# Altium schematic sheet tl494.SchDoc
size A4; SheetNumber: 1; SheetTotal: 8
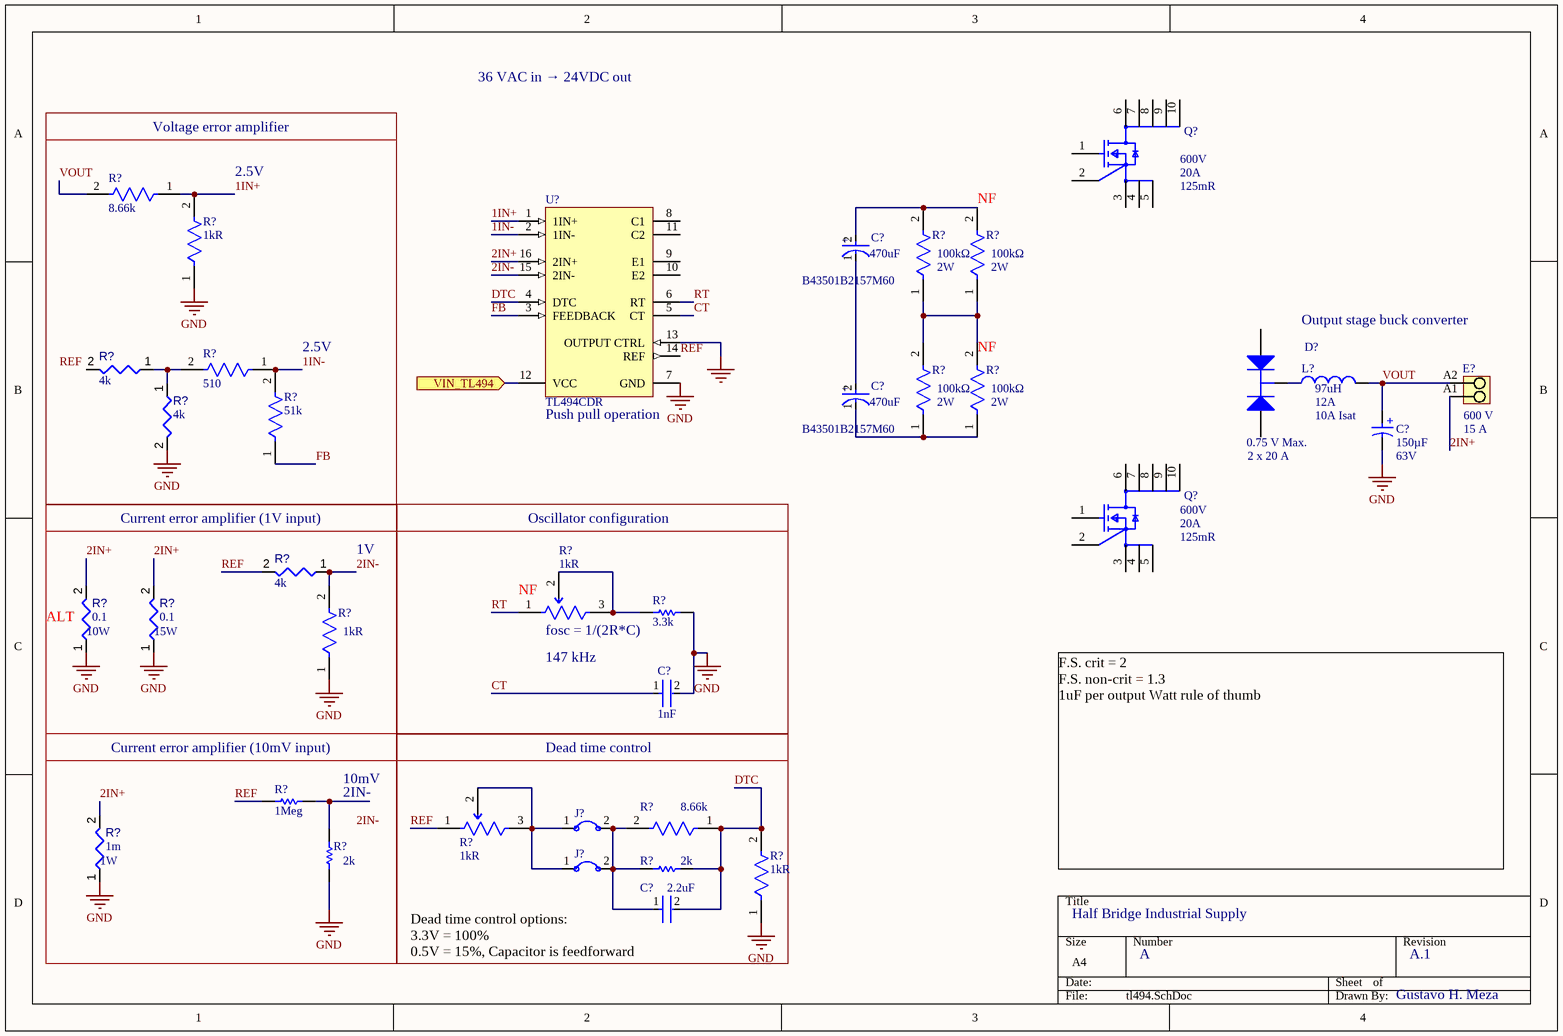
[diagram p0: tl494.SchDoc]

## Parts
(Parts that share a designator on the sheet are numbered #1, #2 ... from top to bottom, then left to right.)
C?#1  Capacitance: 470uF  [FP-EETHC2G471DA-MFG]  (hidden comment: EETHC2G471DA)
C?#2  Capacitance: 470uF  [FP-EETHC2G471DA-MFG]  (hidden comment: EETHC2G471DA)
C?#3  Capacitance: 150µF  Vrating: 63V  [WCAP-ATG5_D10H16]  (hidden comment: 860020775017)
C?#4  Capacitance: 1nF  [FP-0805-L_2_01_0_2-W_1_25-MFG]  (hidden comment: 08051A102JAT2A)
C?#5  Capacitance: 2.2uF  [FP-C2012-125-0_2-IPC_B]  (hidden comment: C2012X7R1H225K125AC)
D?  VF: 0.75 V Max.  IF(AV): 2 x 20 A  [STM-TO-220AB-3]  (hidden comment: STPS40170CT)
E?  Rated_voltage_for_surge_voltage_class_pollution_degree_II_2: 600 V  Rated_current_use_group_B_UL_1059: 15 A  [PM_5_08_90_02]  (hidden comment: 1760490000)
J?#1  JUMPER  [JUMPER]  (value not drawn)
J?#2  JUMPER  [JUMPER]  (value not drawn)
L?  value 97uH  DC Current: 12A  DC Saturation: 10A Isat  [PHBC20-1R7A0097V-Footprint-1]  (hidden comment: PHBC20-1R7A0097V)
Q?#1  Rds On Max: 125mR  Continuous Drain Current (ID): 20A  Drain to Source Voltage (Vdss): 600V  [FP-PG-HDSOP-10-MFG]  (hidden comment: IPDD60R125G7XTMA1)
Q?#2  Rds On Max: 125mR  Continuous Drain Current (ID): 20A  Drain to Source Voltage (Vdss): 600V  [FP-PG-HDSOP-10-MFG]  (hidden comment: IPDD60R125G7XTMA1)
R?#1  Resistance: 8.66k  [FP-RT0805-MFG]  (hidden comment: RT0805BRD078K66L)
R?#2  Resistance: 1kR  [FP-ERA6A-IPC_C]  (hidden comment: ERA6AEB102V)
R?#3  Resistance: 100kΩ  Power Rating: 2W  [FP-PR02000201003JA100-MFG]  (hidden comment: PR02000201003JA100)
R?#4  Resistance: 100kΩ  Power Rating: 2W  [FP-PR02000201003JA100-MFG]  (hidden comment: PR02000201003JA100)
R?#5  value 4k  [RESC3416X05N]  (hidden comment: CRCW08054K00FKTA)
R?#6  Resistance: 510  [FP-CR0805-IPC_B]  (hidden comment: CR0805JW511E)
R?#7  value 4k  [RESC3416X05N]  (hidden comment: CRCW08054K00FKTA)
R?#8  Resistance: 100kΩ  Power Rating: 2W  [FP-PR02000201003JA100-MFG]  (hidden comment: PR02000201003JA100)
R?#9  Resistance: 100kΩ  Power Rating: 2W  [FP-PR02000201003JA100-MFG]  (hidden comment: PR02000201003JA100)
R?#10  Resistance: 51k  [FP-RT0805-MFG]  (hidden comment: RT0805BRD0751KL)
R?#11  value 4k  [RESC3416X05N]  (hidden comment: CRCW08054K00FKTA)
R?#12  Resistance: 1kR  [FP-248FGJSPXB25102MA-MFG]  (hidden comment: 248FGJSPXB25102MA)
R?#13  Resistance: 3.3k  [RESC2013X60X35ML10T20]  (hidden comment: RC0805FR-073K3L)
R?#14  value 0.1  Power: 10W  [20JR10-Footprint-1]  (hidden comment: 20JR10)
R?#15  value 0.1  Power: 15W  [WH10-R10JI-Footprint-1]  (hidden comment: WH10-R10JI)
R?#16  Resistance: 1kR  [FP-ERA6A-IPC_C]  (hidden comment: ERA6AEB102V)
R?#17  Resistance: 1Meg  [RESC3116X65X40ML10T20]  (hidden comment: RT1206BRD071ML)
R?#18  Resistance: 1kR  [FP-248FGJSPXB25102MA-MFG]  (hidden comment: 248FGJSPXB25102MA)
R?#19  Resistance: 8.66k  [FP-RT0805-MFG]  (hidden comment: RT0805BRD078K66L)
R?#20  Resistance: 2k  [RESC2013X60X35ML10T20]  (hidden comment: RT0805BRD072KL)
R?#21  value 1m  Power: 1W  [RESC3416X05N]  (hidden comment: KRL2012E-C-R001-J-T5)
R?#22  Resistance: 2k  [RESC2013X60X35ML10T20]  (hidden comment: RT0805BRD072KL)
R?#23  Resistance: 1kR  [FP-ERA6A-IPC_C]  (hidden comment: ERA6AEB102V)
U?  TL494CDR  [D0016A_N]

## Blocks framed on the sheet
Dead time control: C?#5 J?#1 J?#2 R?#18 R?#19 R?#22 R?#23

## Ports
VIN_TL494 (in)

## Nets
GND: C?#3.2(N) C?#4.2 R?#2.1 R?#7.2 R?#13.1 R?#14.1 R?#15.1 R?#16.1 R?#20.1 R?#21.1 R?#23.1 U?.7(GND) U?.13(OUTPUT_CTRL)
1IN+: R?#1.1 R?#2.2 U?.1(1IN+)
1IN-: R?#6.1 R?#10.2 U?.2(1IN-)
2IN+: E?.A1 R?#14.2 R?#15.2 R?#21.2 U?.16(2IN+)
2IN-: R?#11.1 R?#16.2 U?.15(2IN-)
CT: C?#4.1 U?.5(CT)
DTC: C?#5.2 R?#19.1 R?#22.1 R?#23.2 U?.4(DTC)
FB: R?#10.1 U?.3(FEEDBACK)
REF: R?#11.2 R?#17.2 R?#18.1 U?.14(REF)
RT: R?#12.1 U?.6(RT)
VIN_TL494: U?.12(VCC) ; port VIN_TL494
VOUT: C?#3.1(P) E?.A2 L?.2 R?#1.2
NetC?#1_1: C?#1.1(C) C?#2.2(A)
NetC?#1_2: C?#1.2(A) R?#3.2 R?#4.2
NetC?#2_1: C?#2.1(C) R?#8.1 R?#9.1
NetC?#5_1: C?#5.1 J?#1.2 J?#2.2 R?#19.2 R?#22.2
NetD?_2: D?.2(K) L?.1
NetJ?#1_1: J?#1.1 J?#2.1 R?#18.2(CW) R?#18.3
NetR?#3_1: R?#3.1 R?#4.1 R?#8.2 R?#9.2
NetR?#5_1: R?#5.1 R?#6.2 R?#7.1
NetR?#12_2: R?#12.2(CW) R?#12.3 R?#13.2
NetR?#17_1: R?#17.1 R?#20.2

Not connected (* = marked no-connect by the designer): D? 1(A1) 3(A2); Q?#1 1(Gate) 2(Driver_Source) 3(Source) 4(Source) 5(Source) 6(Drain) 7(Drain) 8(Drain) 9(Drain) 10(Drain); Q?#2 1(Gate) 2(Driver_Source) 3(Source) 4(Source) 5(Source) 6(Drain) 7(Drain) 8(Drain) 9(Drain) 10(Drain); R?#5 2; U? 8(C1) 9(E1) 10(E2) 11(C2)

## Notes on the sheet
- 36 VAC in → 24VDC out
- Voltage error amplifier
- 2.5V
- (near R?#4) NF
- B43501B2157M60
- (near R?#10) 2.5V
- (near R?#9) NF
- Output stage buck converter
- (near U?) Push pull operation
- (near R?#11) Current error amplifier (1V input)
- Oscillator configuration
- (near R?#11) 1V
- (near R?#14) ALT
- (near R?#12) NF
- (near R?#13) fosc = 1/(2R*C)
- (near R?#12) 147 kHz
- (near R?#17) Current error amplifier (10mV input)
- (near R?#17) 10mV
- (near R?#17) 2IN-
- F.S. crit = 2
  F.S. non-crit = 1.3
  1uF per output Watt rule of thumb
- Half Bridge Industrial Supply
- (near C?#5) Dead time control options:
  3.3V = 100%
  0.5V = 15%, Capacitor is feedforward
- A
- A.1
- Gustavo H. Meza
- Labels drawn without touching a wire or pin: 2IN-, REF
- (in symbol CMP-03913-53914258-1) +
- (in symbol CMP-05427-002182-1) +

## Library data of the parts
C?#1 C?#2 = CMP-05427-002182-1: CAP ALUM 470UF 20% 400V SNAP; Lead Diameter: 0.8mm; Dissipation Factor: 15%; Dielectric Material: Aluminium; ESR (Equivalent Series Resistance): 388mR; Ripple Current: 1.68A; Hole Diameter: 2mm; Test Frequency: 120Hz; Life (Hours): 2000Hour; Length: 45mm; Lead Pitch: 10mm; Voltage Rating (DC): 400V; Height - Seated (Max): 1.85inch; Package Quantity: 100; Diameter: 30mm; Min Operating Temperature: -25°C; Mount: Through Hole; Voltage: 400V; Radiation Hardening: No; Reach SVHC Compliant: Yes; Packaging: Bulk; Lead Free: Lead Free; Height: 45mm; Tolerance: 20%; Width: 1.5inch; Case/Package: Radial; Voltage Rating: 400V; Series: TS-HC; Number of Pins: 2; Termination: Snap in; RoHS Compliant: Yes; Max Operating Temperature: 105°C; Ripple Current (AC): 1.68A; Weight: 0.15lb
  C?#1: Vrating: 400V
C?#3 = CMP-03913-53914258-1: 860020775017 Aluminium Electrolytic Capacitor, WCAP-ATG5 Series, 150 F, 20%, 63 V, 10 mm, Radial Leaded; Leakage Current: 94.5µA; Polarity: Polar; Ripple Current: 270mA; Pitch: 5mm; Life (Hours): 2000hours; Case/Package: Radial; Min Operating Temperature: -40°C; Height: 16mm; Lead Pitch: 5.0038mm; Height - Seated (Max): 17.5006mm; Diameter: 10mm; NexarPartId: 53914258; RoHS: Compliant; Tolerance: 20%; Voltage Rating: 63V; REACH SVHC: Unknown; Max Operating Temperature: 105°C; Packaging: Tape & Box (TB); Length: 16mm; Mount: Through Hole; Voltage Rating (DC): 63V
C?#4 = CMP-2007-04527-2: General Purpose Ceramic Capacitor, 0805, 1nF, 5%, C0G, 30ppm/°C, 100V; Insulation Resistance: 100GR; Dissipation Factor: 2.5%; Mount: Surface Mount; Package Quantity: 1; Voltage: 100V; Lead Free: Lead Free; Case/Package: 0805; Voltage Rating: 100V; Dielectric: C0G; Case Code (Metric): 2012; Case Code (Imperial): 0805; REACH SVHC: No SVHC; Number of Pins: 2; Length: 2.01mm; Temperature Coefficient: 30ppm/°C; Depth: 1.25mm; Radiation Hardening: No; RoHS Compliant: Yes; Packaging: Tape and Reel; Min Operating Temperature: -55°C; Contact Plating: Tin; Tolerance: 5%; Termination: SMD/SMT; Height: 0.94mm; Dielectric Material: Ceramic; Thickness: 0.037inch; Voltage Rating (DC): 100V; Max Operating Temperature: 125°C; Width: 1.25mm
C?#5 = CMP-2000-06040-2: Multilayer Ceramic Capacitors 2.2μF ±10% 50V X7R SMD 0805; Mount: Surface Mount; Dielectric Material: Ceramic; Height: 1.25mm; Radiation Hardening: No; Case/Package: 0805; Voltage: 50V; Min Operating Temperature: -55°C; Voltage Rating (DC): 50V; Lead Free: Lead Free; Length: 2mm; Dielectric: X7R; Package Quantity: 1; Contact Plating: Tin; RoHS Compliant: Yes; Series: C; Resistor Type: Ceramic; Voltage Rating: 50V; Case Code (Imperial): 0805; Thickness: 0.057inch; Packaging: Tape and Reel; Depth: 1.25mm; Max Operating Temperature: 125°C; Weight: 0.000194oz; Width: 0.049inch; Tolerance: 10%; Termination: SMD/SMT; Construction: Flat; REACH SVHC: No SVHC; Case Code (Metric): 2012
D? = CMP-1256-00001-1: High Voltage Power Schottky Rectifier, 2-Pin THD (TO-220AB), Tube; Manufacturer: STMicroelectronics; VRRM: 170 V; ComponentLink3URL: http://www.st.com/web/en/resource/technical/document/datasheet/CD00067827.pdf; Mounting Technology: Through Hole; DatasheetVersion: Rev. 1; ComponentLink1URL: http://www.st.com/; ComponentLink1Description: Manufacturer URL; PackageDescription: 3-Pin FM, Body 10.2 x 4.5 mm, Pitch 2.55 mm; Packing: Tube; PartNumber: STPS40170CT; ComponentLink3Description: Package Specification; ComponentLink2Description: Datasheet; ComponentLink2URL: http://www.st.com/web/en/resource/technical/document/datasheet/CD00067827.pdf
E? = CMP-1559-01627-1: OMNIMATE Signal - series PM; Manufacturer: Weidmueller; Contact_surface: tinned; Pitch_mm: 5,08 mm; Solid_min_H05_07_V_U: 0,13 mm²; Wire_cross_section_AWG_min_UL_1059: AWG 26; Wire_cross_section_AWG_max_UL_1059: AWG 14; Mounting_onto_the_PCB: Solder connection; Solder_pin_length_mm: 3,5 mm; Side_termination_characteristic: closed side; Contact_material: Cu-Leg; Pitch_inch: 0,2 inch; No_of_poles: 2; UL_94_flammability_rating: V-0; Insulating_material: Wemid (PA); Rated_voltage_use_group_B_UL_1059: 300 V; Solid_max_H05_07_V_U: 2,5 mm²; Short_text_for_material: PM 5.08/02/90 3.5SN OR BX; Revision: V1; PartNumber: 1760490000; Qty: 500 PCS; ComponentLink2Description: URL Link1; Packaging: Box; PackageReference: PM_5_08_90_02; ComponentLink2URL: http://catalog.weidmueller.com/catalog/Start.do?localeId=en&ObjectID=1760490000; Colour: Orange; ComponentLink1Description: Manufacturer URL; ComponentLink1URL: http://www.weidmueller.com/
J?#1 J?#2 = CMP-009-00061-4: Pins: 2
L? = CMP-006-00024-1: Data Line Filter, 1 Function(s), 12A, 2 Pin(s); RoHS Compliant: Yes
Q?#1 Q?#2 = CMP-32901-001013-1: MOSFET N-CH 600V 20A HDSOP-10; Max Power Dissipation: 120W; Input Capacitance: 1.08nF; Packaging: Cut Tape; Series: CoolMOS™ G7; Mount: Surface Mount; Max Operating Temperature: 150°C; Min Operating Temperature: -55°C; RoHS Compliant: Yes
R?#1 R?#19 = CMP-03412-003563-1: RES 8.66K OHM 1/8W .1% SMD 0805; Manufacturer: Yageo; Tolerance: 0.0025; Voltage Rating: 150V; Power Rating: 0.125W; Value: 8.66KΩ; Temperature Coefficient: 25 ppm/°C; Height: 0.6mm; Lead Free: Yes; Automotive: No; Temperature Range High: +155°C; Mouser Description: Thin Film Resistors - SMD 1/8W 8.66K ohm .1% 25ppm; Temperature Range Low: -55°C; Device Class L3: Chip SMD Resistors; Package: RT0805; Category: Res; Device Class L2: Resistors; ComponentLink2URL: http://www.yageo.com/documents/recent/PYu-RT_1-to-0.01_RoHS_L_9.pdf; Ipc Land Pattern Name: RESC200125X50; Temperature: -55°C to +155°C; Digikey Description: RES 8.66K OHM 1/8W .1% SMD 0805; Footprint Url: http://www.yageo.com/exep/pages/download/literatures/PYu-R_Mount_10.pdf; RoHS: TRUE; Octopart: https://octopart.com/rt0805brd078k66l-yageo-1452032; Manufacturer Part Number: RT0805BRD078K66L; Device Class L1: Passive Components; ComponentLink2Description: Datasheet; Series: RT; Composition: Thin Film
R?#2 R?#16 R?#23 = CMP-2001-00581-2: RES 1K OHM 0.1% 1/8W 0805; Temperature Coefficient: 25ppm/°C; Working Voltage: 100V; Max Power Dissipation: 125mW; Height: 0.5mm; Technology: THIN FILM; REACH SVHC: No SVHC; Packaging: Tape and Reel; Length: 2mm; Width: 1.25mm; Resistance Tolerance: 0.1%; Series: ERA-6A; Resistor Type: Thin Film; Number of Pins: 2; Case Code (Metric): 2012; Voltage Rating: 100V; Radiation Hardening: No; Construction: Rectangular; Mount: Surface Mount; Number of Terminations: 2; Case/Package: 0805; Min Operating Temperature: -55°C; Military Standard: Not; RoHS Compliant: Yes; Termination: SMD/SMT; Case Code (Imperial): 0805; Depth: 1.25mm; Power Rating: 125mW; Max Operating Temperature: 155°C; Contact Plating: Tin; Package Quantity: 5000; Tolerance: 0.1%
R?#3 R?#4 R?#8 R?#9 = CMP-00030-42817933-1: PR02000201003JA100 Fixed Resistor, Metal Film, 2W, 100000ohm, 500V, 5% +/-Tol, 250ppm/Cel, Through Hole Mount; Temperature Coefficient: 250ppm/°C; Case/Package: Conformal; Lead Free: Lead Free; Composition: Metal Film; Schedule B: 8533210090, 8533210090; Tolerance: 5%; RoHS: Compliant; Min Operating Temperature: -55°C; NexarPartId: 42817933; Diameter: 3.9mm; Max Operating Temperature: 155°C; Voltage Rating: 500V; Length: 12mm; Width: 3.9mm; Contact Plating: Tin; REACH SVHC: No SVHC; Operating Supply Voltage: 500V; Termination: Axial; Military Standard: Not; Radiation Hardening: No; Mount: Through Hole; Voltage Rating (DC): 500V
R?#5 R?#7 R?#11 = CMP-009-00184-1: RES SMD 4K OHM 1% 1/8W 0805; Manufacturer Series: CRCW; Power: 125mW; Min Operating Temperature: -55°C; Mounting Technology: Surface Mount; Case/Package: 0805; RoHS Compliant: No; Pins: 2; Tolerance: 1%; JESD-609 Code: e0; Max Operating Temperature: 155°C
R?#6 = CMP-07231-001106-1: Thick Film Chip Resistors 0805 510Ω 0.125W 5% 200ppm/°C; Power Rating: 125mW; Voltage Rating: 150V; Case Code (Imperial): 0805; Case Code (Metric): 2012; Max Operating Temperature: 155°C; Packaging: Tape and Reel; Termination: SMD/SMT; Thickness: 508um; Min Operating Temperature: -55°C; Tolerance: 5%; Height: 0.5mm; Width: 1.25mm; Length: 2mm; Case/Package: 0805; Temperature Coefficient: 200ppm/°C; Package Quantity: 5000
R?#10 = CMP-03412-030464-1: RES SMD 51K OHM 0.1% 1/8W 0805; Manufacturer: Yageo; Tolerance: 0.0025; Value: 51KΩ; Temperature Coefficient: 25 ppm/°C; Voltage Rating: 150V; Power Rating: 0.125W; Device Class L1: Passive Components; Mouser Description: Thin Film Resistors - SMD 1/8W 51K ohm .1% 25ppm; Temperature: -55°C to +155°C; Series: RT; RoHS: TRUE; ComponentLink2Description: Datasheet; Ipc Land Pattern Name: RESC200125X50; Digikey Description: RES SMD 51K OHM 0.1% 1/8W 0805; Category: Res; Temperature Range Low: -55°C; Package: RT0805; Manufacturer Part Number: RT0805BRD0751KL; ComponentLink2URL: http://www.yageo.com/documents/recent/PYu-RT_1-to-0.01_RoHS_L_9.pdf; Device Class L3: Chip SMD Resistors; Height: 0.6mm; Octopart: https://octopart.com/rt0805brd0751kl-yageo-1414977; Footprint Url: http://www.yageo.com/exep/pages/download/literatures/PYu-R_Mount_10.pdf; Composition: Thin Film; Device Class L2: Resistors; Lead Free: Yes; Temperature Range High: +155°C; Automotive: No
R?#12 R?#18 = CMP-02410-000007-1: POT PLASTIC LINEAR; Number of Turns: 1; Hole Diameter: 9.525mm; Insulation Resistance: 1GR; Tolerance: 20%; Temperature Coefficient: 1000ppm/°C; Power Rating: 500mW; Min Operating Temperature: -55°C; Termination: Pin; Mount: Through Hole; Technology: CONDUCTIVE PLASTIC; Max Operating Temperature: 125°C; Military Standard: Not; Length: 30.73mm; Radiation Hardening: No; Depth: 12.7mm; Series: *; Packaging: Bulk; Package Quantity: 50; Height: 13.11mm; RoHS Compliant: Yes; Type: Potentiometer; Resistance Tolerance: 20%; Resistor Type: Potentiometer; Number of Gangs: 1
R?#13 = CMP-1013-00567-2: Chip Resistor, 3.3 KOhm, +/- 1%, 0.125 W, -55 to 155 degC, 0805 (2012 Metric), RoHS, Tape and Reel; Manufacturer: Yageo; Voltage Rating: 150V; Max Power Dissipation: 125mW; Temperature Coefficient: 100ppm/degreesC; Package Quantity: 1; Max Operating Temperature: 155degC; Case Code (Metric): 2012; Package Reference: 0805; Composition: ThickFilm; RoHSCompliant: true; Case/Package: 0805; Case Code (Imperial): 0805; Tolerance: 1%; Depth: 1.25mm; Weight: 0.000194oz; Lead Free: LeadFree; Min Operating Temperature: -55degC; Termination: SMD/SMT; Datasheet Version: Rev. 5, 10/2016; REACH SVHC: NoSVHC; Power Rating: 125mW; Packaging: TapeandReel; Number of Terminations: 2; Width: 0.049inch; Package Description: 2-Pin Surface Mounted Device, Body 2 x 1.25 mm; Datasheet URL: http://www.yageo.com/NewPortal/yageodocoutput?fileName=/pdf/R-Chip/PYu-RC_Group_51_RoHS_L_5.pdf; Height: 0.5mm; Length: 2mm; Manufacturer URL: http://www.yageo.com/
R?#14 = CMP-009-00186-1: Fixed Resistor, Wire Wound, 10W, 0.1ohm, 720V, 5% +/-Tol, Through Hole Mount; Lead Length: 38.1mm; Lead Diameter: 0.813mm; Pins: 2; JESD-609 Code: e0; Tolerance: 5%; Max Operating Temperature: 350°C; Mounting Technology: Through Hole; RoHS Compliant: No; Construction: All-Welded
R?#15 = CMP-009-00185-1: Fixed Resistor, Wire Wound, 15W, 0.1ohm, 250V, 5% +/-Tol, 75ppm/Cel, Chassis Mount; Pins: 2; Max Operating Temperature: 200°C; RoHS Compliant: Yes; Tolerance: 5%; Min Operating Temperature: -55°C; Mounting Technology: Chassis Mount; Case/Package: 8383
R?#17 = CMP-2003-04285-1: Manufacturer: Yageo; Part Number: RT1206BRD071ML
R?#20 R?#22 = CMP-2001-01732-1: Manufacturer: Yageo; Part Number: RT0805BRD072KL
R?#21 = CMP-009-00187-1: Fixed Resistor, Metal Foil, 1W, 0.001ohm, 5% +/-Tol, 150ppm/Cel, Surface Mount, 0805; Case/Package: 0805; Max Operating Temperature: 175°C; Mounting Technology: Surface Mount; Pins: 2; Min Operating Temperature: -55°C; RoHS Compliant: Yes; Tolerance: 5%; Construction: Rectangular
U? = CMP-0319-00950-2: Pulse-Width-Modulation Control Circuit with Voltage Control, 45 % Duty Cycle, 0 to +70 degC, 16-pin SOIC (D), Green (RoHS & no Sb/Br); Manufacturer: Texas Instruments; Regulated Outputs(#): 2; Frequency(Max)(kHz): 300; Topology: Boost, Buck, Flyback, Forward, Full-Bridge, Half-Bridge, Push-Pull; SubFamily: PWM Controller; Duty Cycle(Max)(%): 45; Rating: Military; PackageDescription: 16-Pin Plastic Small Outline Integrated Circuit, 9.9 x 3.9 mm, Pitch 1.27 mm Pitch; Mounting Technology: Surface Mount; PackageReference: D0016A; DatasheetVersion: SLVS074E; Control Method: Voltage; ComponentLink1Description: Datasheet; ComponentLink1URL: http://www.ti.com/general/docs/lit/getliterature.tsp?genericPartNumber=TL494&fileType=pdf; Code_JEDEC: MS-012AC; Eco-Plan: Green (RoHS & no Sb/Br); PackageVersion: revM, Jun-2011; PartNumber: TL494CDR